# EAGLE design PrelimanaryV3 (EAGLE 9.5.2)
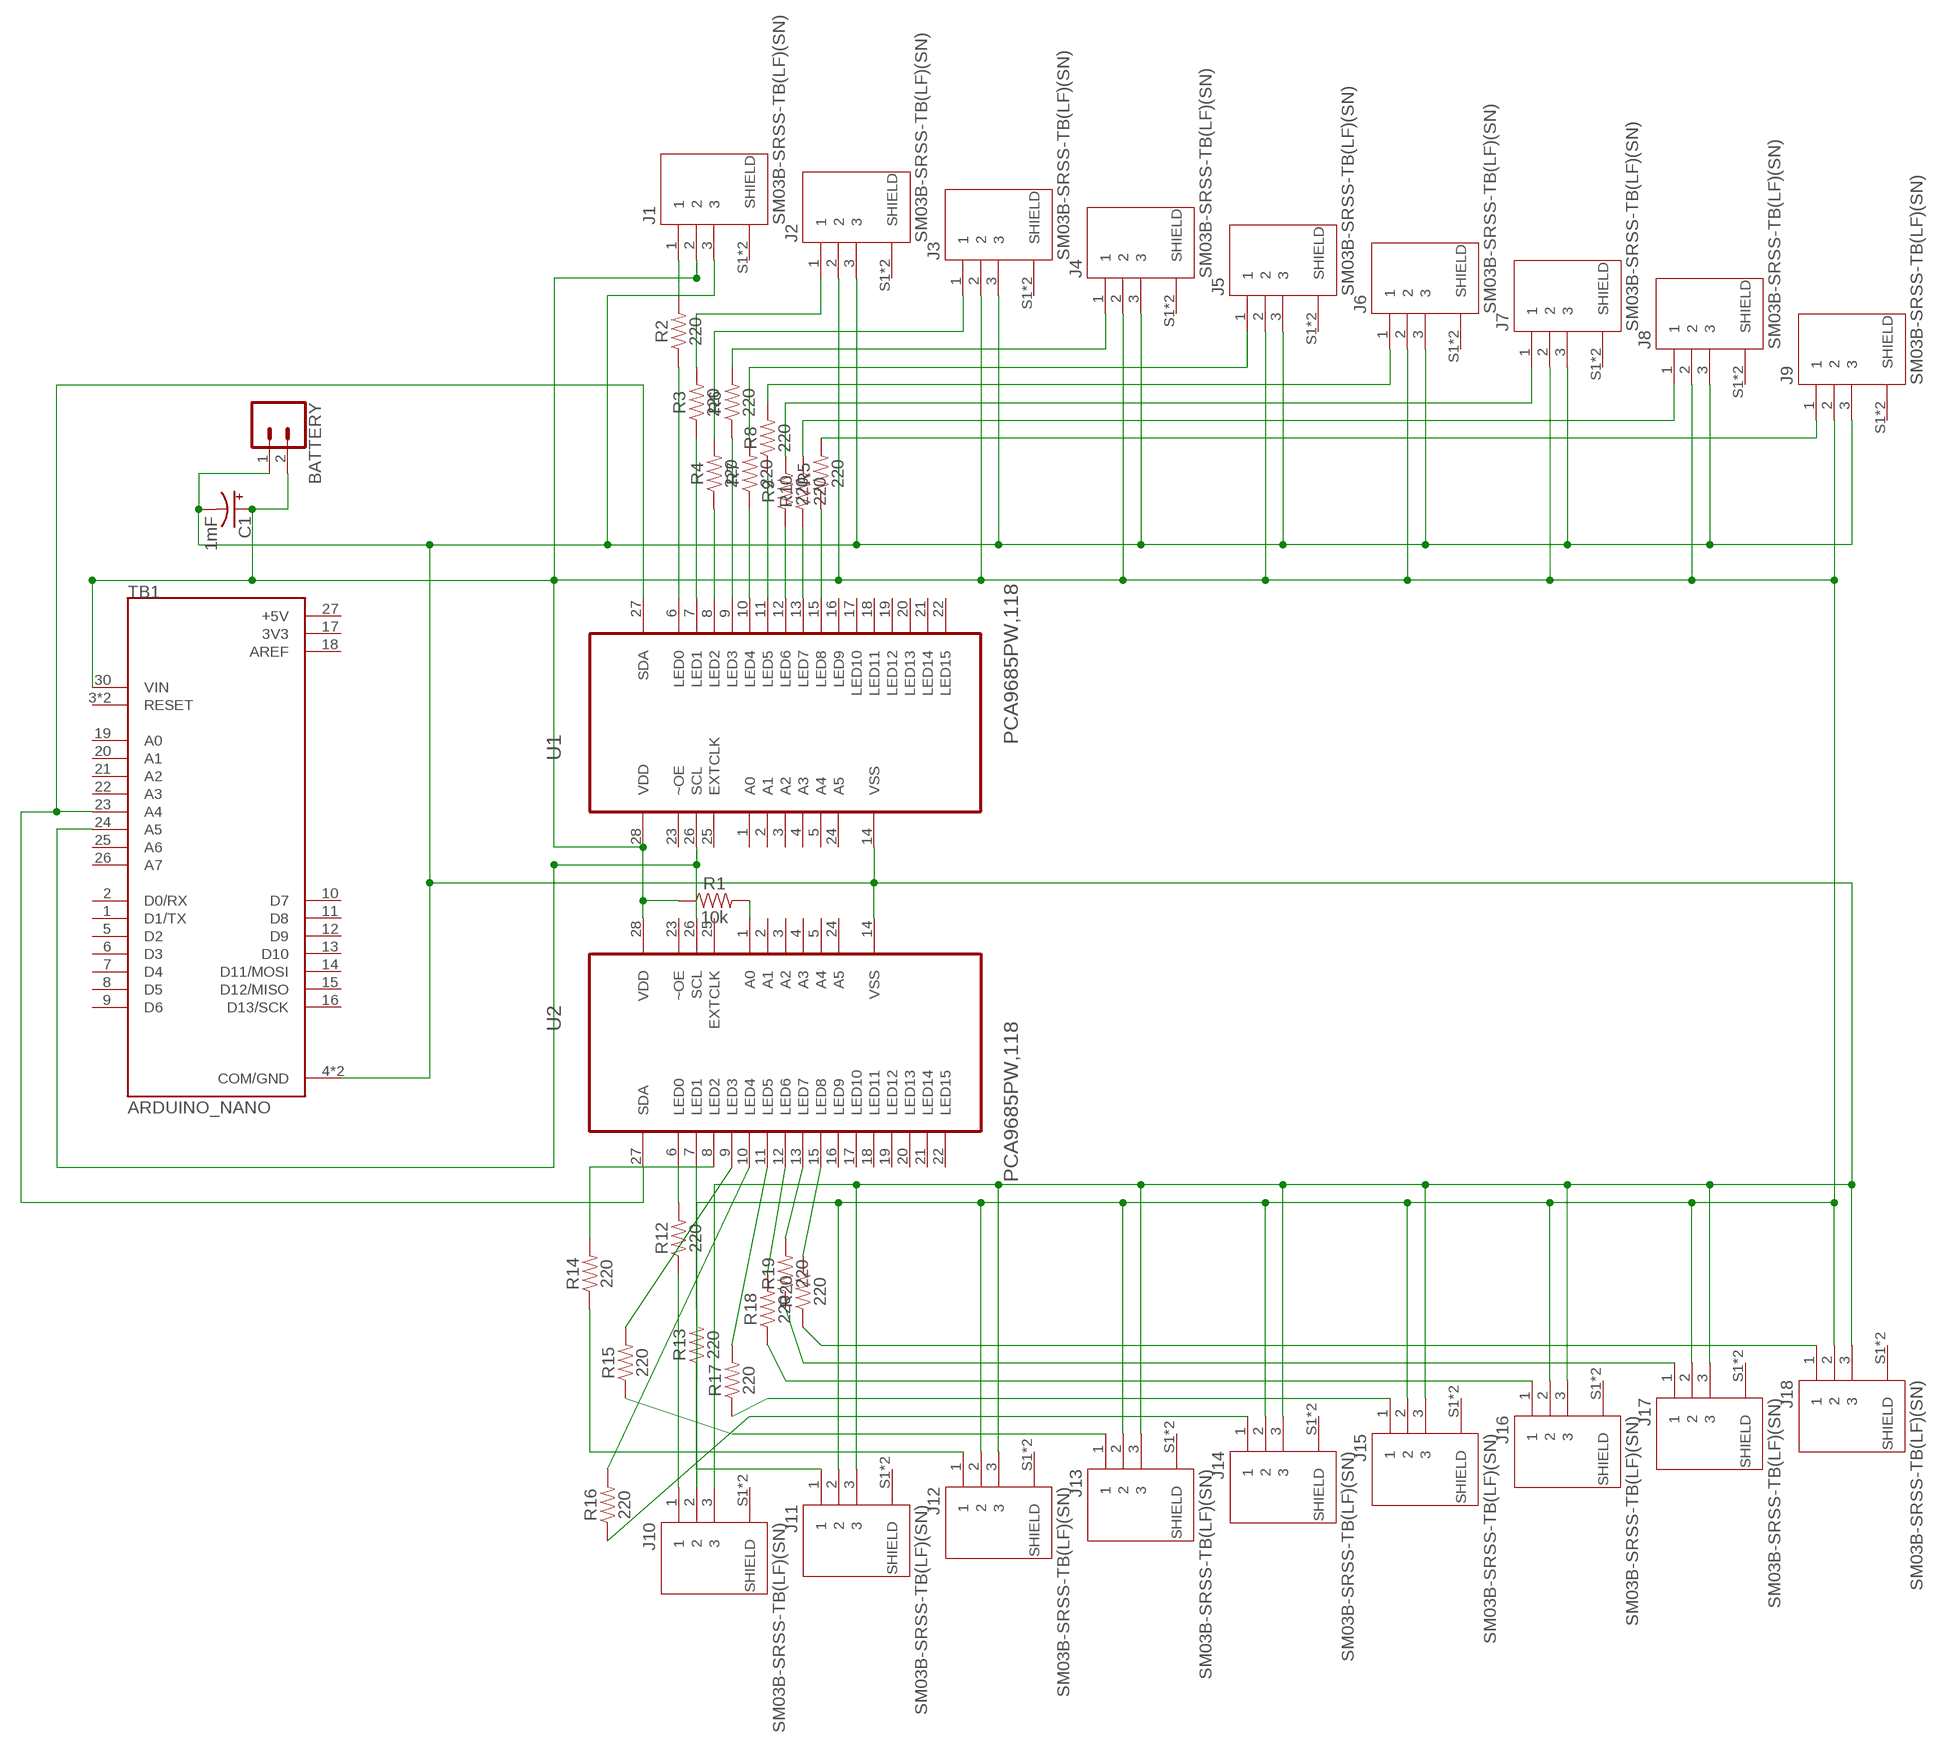
[diagram p0: schematic, sheet 1]

## Parts
BATTERY  CONN_021X02_NO_SILK  [1X02_NO_SILK]
C1  1mF  1000UF-RADIAL-5MM-25V-20%  [CPOL-RADIAL-5MM-10MM]
J1  SM03B-SRSS-TB(LF)(SN)  [JST_SM03B-SRSS-TB(LF)(SN)]
J2  SM03B-SRSS-TB(LF)(SN)  [JST_SM03B-SRSS-TB(LF)(SN)]
J3  SM03B-SRSS-TB(LF)(SN)  [JST_SM03B-SRSS-TB(LF)(SN)]
J4  SM03B-SRSS-TB(LF)(SN)  [JST_SM03B-SRSS-TB(LF)(SN)]
J5  SM03B-SRSS-TB(LF)(SN)  [JST_SM03B-SRSS-TB(LF)(SN)]
J6  SM03B-SRSS-TB(LF)(SN)  [JST_SM03B-SRSS-TB(LF)(SN)]
J7  SM03B-SRSS-TB(LF)(SN)  [JST_SM03B-SRSS-TB(LF)(SN)]
J8  SM03B-SRSS-TB(LF)(SN)  [JST_SM03B-SRSS-TB(LF)(SN)]
J9  SM03B-SRSS-TB(LF)(SN)  [JST_SM03B-SRSS-TB(LF)(SN)]
J10  SM03B-SRSS-TB(LF)(SN)  [JST_SM03B-SRSS-TB(LF)(SN)]
J11  SM03B-SRSS-TB(LF)(SN)  [JST_SM03B-SRSS-TB(LF)(SN)]
J12  SM03B-SRSS-TB(LF)(SN)  [JST_SM03B-SRSS-TB(LF)(SN)]
J13  SM03B-SRSS-TB(LF)(SN)  [JST_SM03B-SRSS-TB(LF)(SN)]
J14  SM03B-SRSS-TB(LF)(SN)  [JST_SM03B-SRSS-TB(LF)(SN)]
J15  SM03B-SRSS-TB(LF)(SN)  [JST_SM03B-SRSS-TB(LF)(SN)]
J16  SM03B-SRSS-TB(LF)(SN)  [JST_SM03B-SRSS-TB(LF)(SN)]
J17  SM03B-SRSS-TB(LF)(SN)  [JST_SM03B-SRSS-TB(LF)(SN)]
J18  SM03B-SRSS-TB(LF)(SN)  [JST_SM03B-SRSS-TB(LF)(SN)]
R1  10k  10KOHM-0402-1/16W-1%  [0402]
R2  220  220OHM-0603-1/10W-1%  [0603]
R3  220  220OHM-0603-1/10W-1%  [0603]
R4  220  220OHM-0603-1/10W-1%  [0603]
R5  220  220OHM-0603-1/10W-1%  [0603]
R6  220  220OHM-0603-1/10W-1%  [0603]
R7  220  220OHM-0603-1/10W-1%  [0603]
R8  220  220OHM-0603-1/10W-1%  [0603]
R9  220  220OHM-0603-1/10W-1%  [0603]
R10  220  220OHM-0603-1/10W-1%  [0603]
R12  220  220OHM-0603-1/10W-1%  [0603]
R13  220  220OHM-0603-1/10W-1%  [0603]
R14  220  220OHM-0603-1/10W-1%  [0603]
R15  220  220OHM-0603-1/10W-1%  [0603]
R16  220  220OHM-0603-1/10W-1%  [0603]
R17  220  220OHM-0603-1/10W-1%  [0603]
R18  220  220OHM-0603-1/10W-1%  [0603]
R19  220  220OHM-0603-1/10W-1%  [0603]
R20  220  220OHM-0603-1/10W-1%  [0603]
TB1  ARDUINO_NANO  [SHIELD_ARDUINO_NANO]
U1  PCA9685PW,118  [SOP65P640X110-28N]
U2  PCA9685PW,118  [SOP65P640X110-28N]

## Nets
N$1: R2.1 U1.6(LED0)
N$2: J2.1 R3.2
N$3: J3.1 R4.2
N$4: BATTERY.1 C1.- J1.3 J2.3 J3.3 J4.3 J5.3 J6.3 J7.3 J8.3 J9.3 J10.3 J11.3 J12.3 J13.3 J14.3 J15.3 J16.3 J17.3 J18.3 TB1.4(COM/GND) TB1.29(COM/GND) U1.14(VSS) U2.14(VSS)
N$5: TB1.23(A4) U1.27(SDA) U2.27(SDA)
N$6: TB1.24(A5) U1.26(SCL) U2.26(SCL)
N$7: J1.1 R2.2
N$8: J4.1 R6.2
N$9: J5.1 R7.2
N$10: J6.1 R8.2
N$11: J7.1 R9.2
N$12: J8.1 R10.2
N$13: J9.1 R5.2
N$14: J10.1 R12.1
N$15: J11.1 R13.1
N$16: J12.1 R14.1
N$17: J13.1 R15.1
N$18: J14.1 R16.1
N$19: J15.1 R17.1
N$20: J16.1 R18.1
N$21: J17.1 R19.1
N$22: J18.1 R20.1
N$23: BATTERY.2 C1.+ J1.2 J2.2 J3.2 J4.2 J5.2 J6.2 J7.2 J8.2 J9.2 J10.2 J11.2 J12.2 J13.2 J14.2 J15.2 J16.2 J17.2 J18.2 R1.1 TB1.30(VIN) U1.28(VDD) U2.28(VDD)
N$24: R3.1 U1.7(LED1)
N$25: R4.1 U1.8(LED2)
N$26: R6.1 U1.9(LED3)
N$27: R7.1 U1.10(LED4)
N$28: R8.1 U1.11(LED5)
N$29: R9.1 U1.12(LED6)
N$30: R10.1 U1.13(LED7)
N$31: R12.2 U2.6(LED0)
N$32: R13.2 U2.7(LED1)
N$33: R15.2 U2.9(LED3)
N$34: R16.2 U2.10(LED4)
N$35: R17.2 U2.11(LED5)
N$36: R18.2 U2.12(LED6)
N$37: R19.2 U2.13(LED7)
N$38: R20.2 U2.15(LED8)
N$39: R14.2 U2.8(LED2)
N$41: R5.1 U1.15(LED8)
N$42: R1.2 U2.1(A0)
Unconnected: J1.S1(SHIELD) J1.S2(SHIELD) J2.S1(SHIELD) J2.S2(SHIELD) J3.S1(SHIELD) J3.S2(SHIELD) J4.S1(SHIELD) J4.S2(SHIELD) J5.S1(SHIELD) J5.S2(SHIELD) J6.S1(SHIELD) J6.S2(SHIELD) J7.S1(SHIELD) J7.S2(SHIELD) J8.S1(SHIELD) J8.S2(SHIELD) J9.S1(SHIELD) J9.S2(SHIELD) J10.S1(SHIELD) J10.S2(SHIELD) J11.S1(SHIELD) J11.S2(SHIELD) J12.S1(SHIELD) J12.S2(SHIELD) J13.S1(SHIELD) J13.S2(SHIELD) J14.S1(SHIELD) J14.S2(SHIELD) J15.S1(SHIELD) J15.S2(SHIELD) J16.S1(SHIELD) J16.S2(SHIELD) J17.S1(SHIELD) J17.S2(SHIELD) J18.S1(SHIELD) J18.S2(SHIELD) TB1.1(D1/TX) TB1.2(D0/RX) TB1.3(RESET) TB1.5(D2) TB1.6(D3) TB1.7(D4) TB1.8(D5) TB1.9(D6) TB1.10(D7) TB1.11(D8) TB1.12(D9) TB1.13(D10) TB1.14(D11/MOSI) TB1.15(D12/MISO) TB1.16(D13/SCK) TB1.19(A0) TB1.20(A1) TB1.21(A2) TB1.22(A3) TB1.25(A6) TB1.26(A7) TB1.28(RESET) U1.1(A0) U1.2(A1) U1.3(A2) U1.4(A3) U1.5(A4) U1.16(LED9) U1.17(LED10) U1.18(LED11) U1.19(LED12) U1.20(LED13) U1.21(LED14) U1.22(LED15) U1.23(~OE) U1.24(A5) U1.25(EXTCLK) U2.2(A1) U2.3(A2) U2.4(A3) U2.5(A4) U2.16(LED9) U2.17(LED10) U2.18(LED11) U2.19(LED12) U2.20(LED13) U2.21(LED14) U2.22(LED15) U2.23(~OE) U2.24(A5) U2.25(EXTCLK)

## Power pins joined to a net without a drawn wire
3V3: TB1.17(3V3)
+5V: TB1.27(+5V)
AREF: TB1.18(AREF)

## Library data of the parts
BATTERY = SparkFun-Connectors:CONN_02: Multi connection point. Often used as Generic Header-pin footprint for 0.1 inch spaced/style header connections On any of the 0.1 inch spaced packages, you can populate with these: Break Away Headers - Straight <https://www.sparkfun.com/products/116> (PRT-00116) Break Away Male Headers - Right Angle <https://www.sparkfun.com/products/553> (PRT-00553) Female Headers <https://www.sparkfun.com/products/115> (PRT-00115) Break Away Headers - Machine Pin <https://www.sparkfun.com/products/117> (PRT-00117) Break Away Female Headers - Swiss Machine Pin <https://www.sparkfun.com/products/743> (PRT-00743) For SCREWTERMINALS and SPRING TERMINALS visit here: Screw Terimnals on SparkFun.com <https://www.sparkfun.com/search/results?term=Screw+Terminals> (5mm/3.5mm/2.54mm spacing) This device is also useful as a general connection point to wire up your design to another part of your project. Our various solder wires solder well into these plated through hole pads. Hook-Up Wire - Assortment (Stranded, 22 AWG) <https://www.sparkfun.com/products/11375> (PRT-11375) Hook-Up Wire - Assortment (Solid Core, 22 AWG) <https://www.sparkfun.com/products/11367> (PRT-11367) View the entire wire category on our website here <https://www.sparkfun.com/categories/141> Special notes: Molex polarized connector foot print use with: PRT-08233 with associated crimp pins and housings. 2.54_SCREWTERM for use with PRT-10571. 3.5mm Screw Terminal footprints for PRT-08084 5mm Screw Terminal footprints for use with PRT-08432
C1 = SparkFun-Capacitors:1000UF: 1,000µF/1mF ceramic capacitors A capacitor is a passive two-terminal electrical component used to store electrical energy temporarily in an electric field. CAP-08070; PROD_ID: CAP-09538
J1-J18 = JST-SH:SM03B-SRSS-TB(LF)(SN): SH Series 3 Position 1 mm Pitch Surface Mount Side Entry Shrouded Header; AVAILABILITY: Unavailable; DESCRIPTION: CONN HEADER SMD R/A 3POS 1MM; MF: JST Sales; MP: SM03B-SRSS-TB_LF__SN_; PACKAGE: None; PRICE: None
R1 = SparkFun-Resistors:10KOHM: 10kΩ resistor A resistor is a passive two-terminal electrical component that implements electrical resistance as a circuit element. Resistors act to reduce current flow, and, at the same time, act to lower voltage levels within circuits. - Wikipedia; PROD_ID: RES-14241
R2-R10 R12-R20 = SparkFun-Resistors:220OHM: 220Ω resistor A resistor is a passive two-terminal electrical component that implements electrical resistance as a circuit element. Resistors act to reduce current flow, and, at the same time, act to lower voltage levels within circuits. - Wikipedia; PROD_ID: RES-07861
TB1 = ARDUINO_NANO:ARDUINO_NANO: Arduino Nano, Through Hole; AVAILABILITY: Unavailable; DESCRIPTION: Dev.kit: Arduino; UART; ICSP, USB B mini, pin strips; MF: Arduino; MP: ARDUINO NANO; PACKAGE: None; PRICE: None
U1 U2 = PCA9685PW_118:PCA9685PW,118: 16-channel, 12-bit PWM Fm+ I2C-bus LED controller; AVAILABILITY: Unavailable; DESCRIPTION: PCA9685 Series 5.5V 25 mA 1 MHz 12-bit PWM Fm+I2C-Bus LED Controller - TSSOP-28; MF: NXP USA; MP: PCA9685PW,118; PACKAGE: TSSOP-28 NXP Semiconductors; PRICE: None

## Board
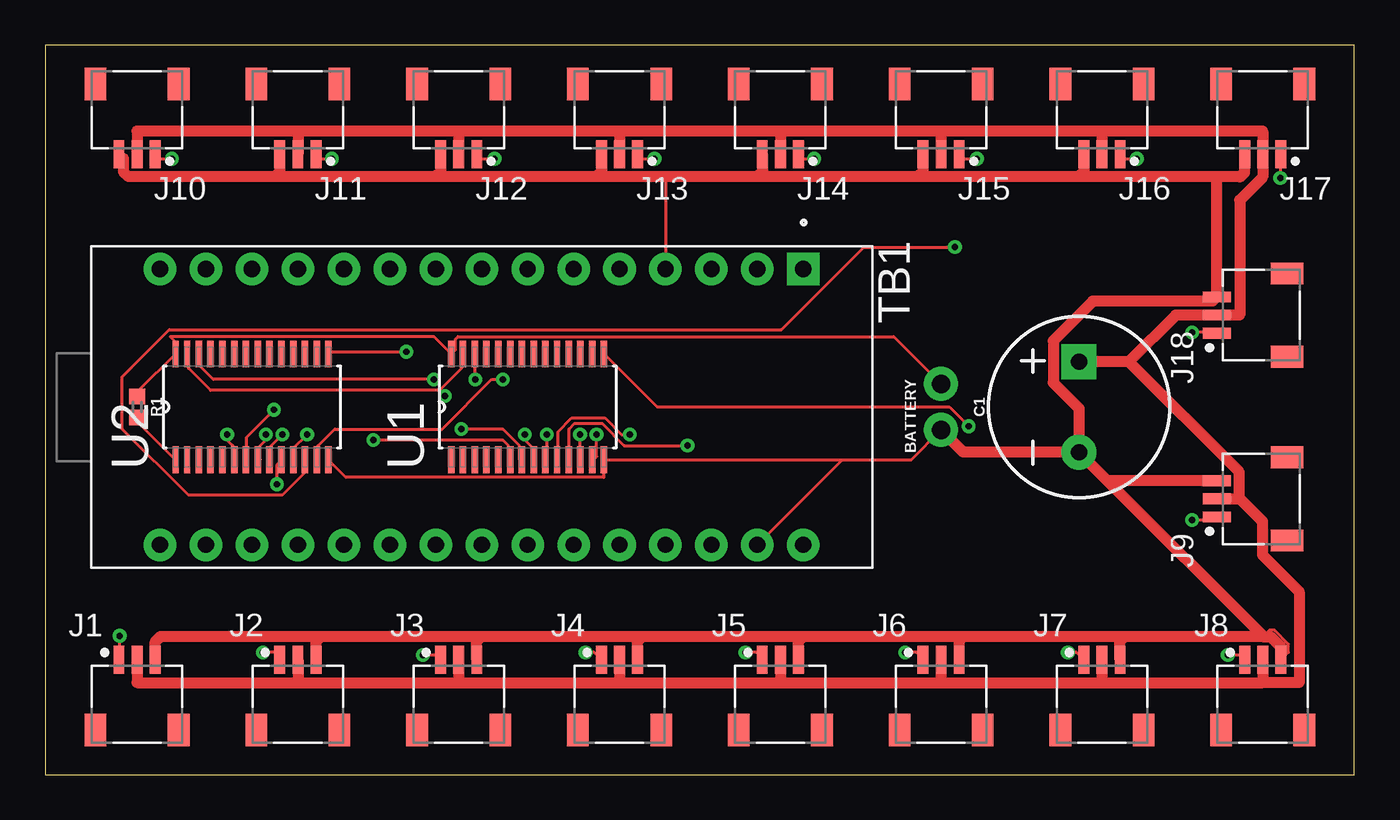
[diagram p1: board, top side]
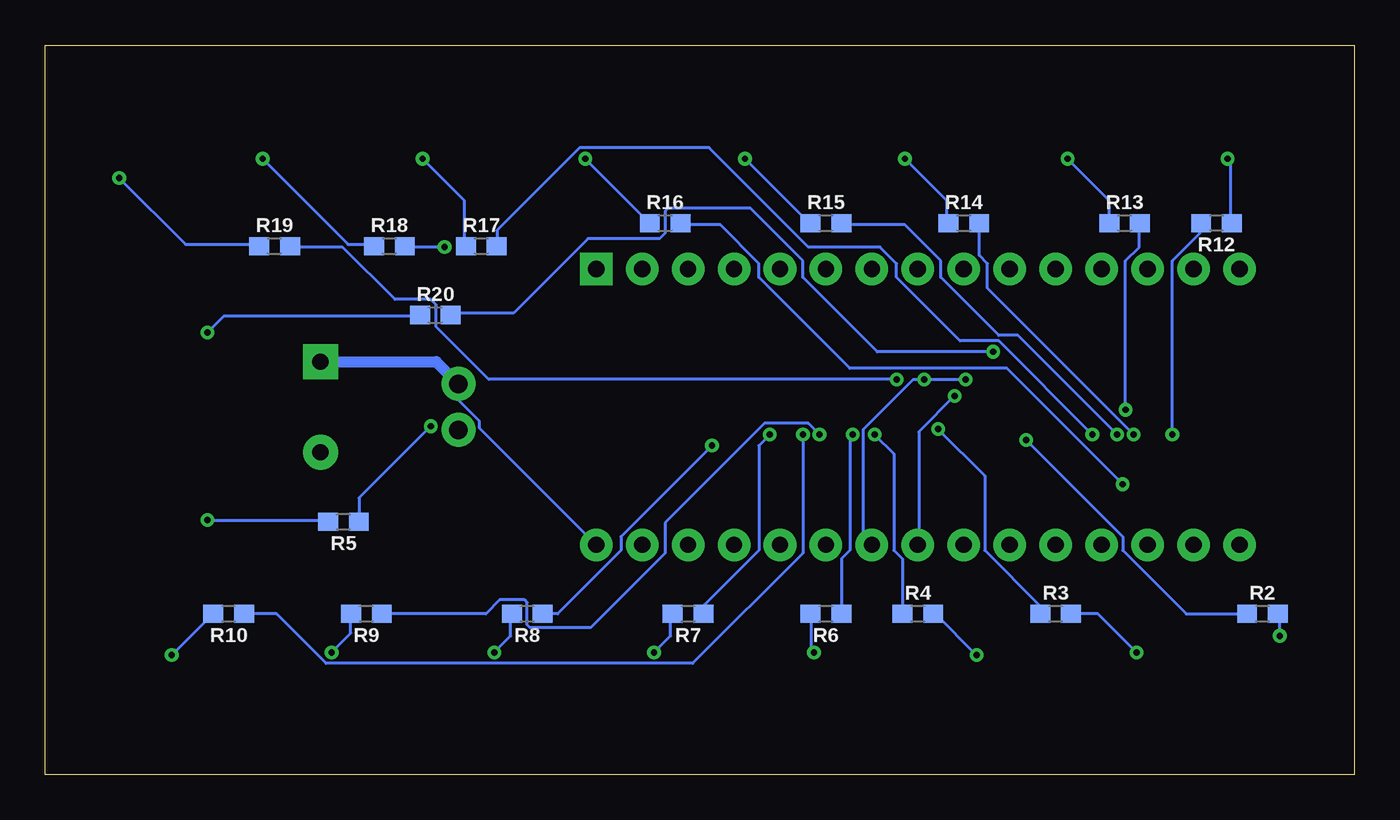
[diagram p2: board, bottom side, seen from below]

Size 72.37 x 40.31 mm. Coordinates in mm from the lower left corner, seen from the top.
Outline: 0,0 72.37,0 72.37,40.31 0,40.31 0,0
Copper layers (1*16): Top 0.035mm / dielectric 1.5mm / Bottom 0.035mm
Design rules "default": minimum track width 6mil, minimum drill 0.35mm, track to track 6mil, track to pad 6mil, pad to pad 6mil, via to via 6mil, smd to smd 6mil, copper to edge 40mil, drill to drill 6mil, minimum pad ring 10mil, minimum via ring 8mil, stop-mask expansion 4mil, vias tented up to drill 0mil, thermal gap 10mil

### Footprints (pad centres in the part's own frame; a part is rotated, then mirrored left to right if it is on the bottom)
1X02_NO_SILK = drill 1.016 pad 1.88: 1 0,0; 2 2.54,0
CPOL-RADIAL-5MM-10MM = drill 0.9 pad 1.93 square: + 2.5,0 | drill 0.9 pad 1.93: - -2.5,0
JST_SM03B-SRSS-TB(LF)(SN) = smd 0.6 x 1.55: 1 -1,0; 2 0,0; 3 1,0 | smd 1.2 x 1.8: S1 -2.3,-3.875; S2 2.3,-3.875
0402 = smd 0.85 x 0.9: 1 -0.58,0; 2 0.58,0
0603 = smd 1.1 x 1: 1 -0.85,0; 2 0.85,0
SHIELD_ARDUINO_NANO = drill 0.9 pad 1.8 square: 1 -7.62,17.78 | drill 0.9 pad 1.8: 2 -7.62,15.24; 3 -7.62,12.7; 4 -7.62,10.16; 5 -7.62,7.62; 6 -7.62,5.08; 7 -7.62,2.54; 8 -7.62,0; 9 -7.62,-2.54; 10 -7.62,-5.08; 11 -7.62,-7.62; 12 -7.62,-10.16; 13 -7.62,-12.7; 14 -7.62,-15.24; 15 -7.62,-17.78; 16 7.62,-17.78; 17 7.62,-15.24; 18 7.62,-12.7; 19 7.62,-10.16; 20 7.62,-7.62; 21 7.62,-5.08; 22 7.62,-2.54; 23 7.62,0; 24 7.62,2.54; 25 7.62,5.08; 26 7.62,7.62; 27 7.62,10.16; 28 7.62,12.7; 29 7.62,15.24; 30 7.62,17.78
SOP65P640X110-28N = smd 1.473 x 0.356: 1 -2.921,4.216; 2 -2.921,3.581; 3 -2.921,2.921; 4 -2.921,2.286; 5 -2.921,1.626; 6 -2.921,0.965; 7 -2.921,0.33; 8 -2.921,-0.33; 9 -2.921,-0.965; 10 -2.921,-1.626; 11 -2.921,-2.286; 12 -2.921,-2.921; 13 -2.921,-3.581; 14 -2.921,-4.216; 15 2.921,-4.216; 16 2.921,-3.581; 17 2.921,-2.921; 18 2.921,-2.286; 19 2.921,-1.626; 20 2.921,-0.965; 21 2.921,-0.33; 22 2.921,0.33; 23 2.921,0.965; 24 2.921,1.626; 25 2.921,2.286; 26 2.921,2.921; 27 2.921,3.581; 28 2.921,4.216

### Placement (x,y rotation side)
BATTERY  49.53,19.05 90 top
C1  57.15,20.32 90 top
J1  5.08,6.35 0 top
J2  13.97,6.35 0 top
J3  22.86,6.35 0 top
J4  31.75,6.35 0 top
J5  40.64,6.35 0 top
J6  49.53,6.35 0 top
J7  58.42,6.35 0 top
J8  67.31,6.35 0 top
J9  64.77,15.24 90 top
J10  5.08,34.29 180 top
J11  13.97,34.29 180 top
J12  22.86,34.29 180 top
J13  31.75,34.29 180 top
J14  40.64,34.29 180 top
J15  49.53,34.29 180 top
J16  58.42,34.29 180 top
J17  67.31,34.29 180 top
J18  64.77,25.4 90 top
R1  5.08,20.32 270 top
R2  5.08,8.89 0 bottom
R3  16.51,8.89 0 bottom
R4  24.13,8.89 0 bottom
R5  55.88,13.97 180 bottom
R6  29.21,8.89 180 bottom
R7  36.83,8.89 180 bottom
R8  45.72,8.89 180 bottom
R9  54.61,8.89 180 bottom
R10  62.23,8.89 180 bottom
R12  7.62,30.48 180 bottom
R13  12.7,30.48 0 bottom
R14  21.59,30.48 0 bottom
R15  29.21,30.48 0 bottom
R16  38.1,30.48 0 bottom
R17  48.26,29.21 0 bottom
R18  53.34,29.21 0 bottom
R19  59.69,29.21 0 bottom
R20  50.8,25.4 0 bottom
TB1  24.13,20.32 270 top
U1  26.67,20.32 90 top
U2  11.43,20.32 90 top

### Tracks (layer width: path | path; a pad name or v marks a point on that pad's centre or on a via)
N$1  (via drill 0.35)
  Top 0.152: v18.14,18.49 25.3,18.49 25.6,18.19 25.6,17.42 U1.6
  Bottom 0.152: R2.1 9.3,8.89 12.8,12.39 12.8,13.16 v18.14,18.49
N$2  (via drill 0.35)
  Top 0.152: v12.04,6.76 12.65,6.76 12.95,6.45 J2.1
  Bottom 0.152: R3.2 14.17,8.89 v12.04,6.76
N$3  (via drill 0.35)
  Top 0.152: v20.88,6.6 21.64,6.6 21.79,6.45 J3.1
  Bottom 0.152: v20.88,6.6 23.16,8.89 R4.2
N$4
  Top 0.152: U2.14 16.61,16.43 30.89,16.43 U1.14 44.07,17.4 | 44.07,17.4 47.88,17.4 BATTERY.1 | TB1.29 44.07,17.4 | J10.3 4.11,34.19 4.32,34.05 | 67.33,7.64 67.67,7.98 67.97,7.98 68.73,7.21 68.73,6.76 68.43,6.45 J8.3 | 34.29,33.06 TB1.4
  Top 0.61: 68.31,7.07 67.76,7.62 67.35,7.62 67.33,7.64 | 12.7,33.06 4.59,33.06 4.32,33.33 4.32,34.05 | 12.7,33.06 21.59,33.06 | 21.59,33.06 30.48,33.06 | 30.48,33.06 34.29,33.06 39.37,33.06 | 39.37,33.06 48.26,33.06 | 48.26,33.06 57.15,33.06 | 57.15,33.06 64.77,33.06 | 64.77,33.06 66,33.06 66.04,33.02 66.31,33.29 J17.3 | 64.77,33.06 J18.3 64.53,26.16 57.91,26.16 55.73,23.97 55.73,21.66 57.15,20.24 C1.- | J11.3 12.97,33.33 12.7,33.06 | J12.3 21.86,33.33 21.59,33.06 | J13.3 30.75,33.33 30.48,33.06 | J14.3 39.64,33.33 39.37,33.06 | J15.3 48.53,33.33 48.26,33.06 | J16.3 57.42,33.33 57.15,33.06 | C1.- 50.76,17.82 BATTERY.1 | C1.- 58.73,16.24 | 58.73,16.24 67.33,7.64 | J1.3 6.08,7.35 6.37,7.64 15.24,7.64 | 15.24,7.64 24.13,7.64 | 24.13,7.64 33.02,7.64 | 33.02,7.64 41.91,7.64 | 41.91,7.64 50.8,7.64 | 50.8,7.64 59.69,7.64 | 59.69,7.64 67.33,7.64 | J2.3 14.97,7.37 15.24,7.64 | J3.3 23.86,7.37 24.13,7.64 | J4.3 32.75,7.37 33.02,7.64 | J5.3 41.64,7.37 41.91,7.64 | J6.3 50.53,7.37 50.8,7.64 | J7.3 59.42,7.37 59.69,7.64 | J9.3 58.73,16.24
N$5  (via drill 0.35)
  Top 0.152: 21.79,21.23 9.14,21.23 7.92,22.45 7.92,23.22 U2.27 | 21.79,21.23 23.01,22.45 23.01,23.22 U1.27 | 21.79,21.23 v22.1,20.93
  Bottom 0.152: v22.1,20.93 24.08,18.95 24.08,12.7 TB1.23
N$6  (via drill 0.35)
  Top 0.152: v21.49,21.84 9.3,21.84 8.53,22.61 8.53,23.22 U2.26 | v23.77,21.84 23.77,23.22 U1.26
  Bottom 0.152: v21.49,21.84 v23.77,21.84 24.38,21.84 27.13,19.1 27.13,13.16 TB1.24
N$7  (via drill 0.35)
  Top 0.152: v4.11,7.67 4.11,6.45 J1.1
  Bottom 0.152: v4.11,7.67 4.11,8.89 R2.2
N$8  (via drill 0.35)
  Top 0.152: v29.87,6.76 30.33,6.76 30.63,6.45 J4.1
  Bottom 0.152: v29.87,6.76 30.02,6.91 30.02,8.89 R6.2
N$9  (via drill 0.35)
  Top 0.152: v38.71,6.76 39.32,6.76 39.62,6.45 J5.1
  Bottom 0.152: v38.71,6.76 37.8,7.67 37.8,8.89 R7.2
N$10  (via drill 0.35)
  Top 0.152: v47.55,6.76 48.16,6.76 48.46,6.45 J6.1
  Bottom 0.152: v47.55,6.76 46.63,7.67 46.63,8.89 R8.2
N$11  (via drill 0.35)
  Top 0.152: v56.54,6.76 57,6.76 57.3,6.45 J7.1
  Bottom 0.152: v56.54,6.76 55.47,7.82 55.47,8.89 R9.2
N$12  (via drill 0.35)
  Top 0.152: v65.38,6.6 66.14,6.6 66.29,6.45 J8.1
  Bottom 0.152: v65.38,6.6 63.09,8.89 R10.2
N$13  (via drill 0.35)
  Top 0.152: v63.4,14.07 64.62,14.07 64.77,14.22 J9.1
  Bottom 0.152: v63.4,14.07 56.85,14.07 R5.2
N$14  (via drill 0.35)
  Top 0.152: v7.01,34.04 6.25,34.04 6.1,34.19 J10.1
  Bottom 0.152: v7.01,34.04 6.86,33.88 6.86,30.53 R12.1
N$15  (via drill 0.35)
  Top 0.152: v15.85,34.04 15.24,34.04 15.09,34.19 J11.1
  Bottom 0.152: v15.85,34.04 13.56,31.75 13.56,30.53 R13.1
N$16  (via drill 0.35)
  Top 0.152: v24.84,34.04 24.08,34.04 23.93,34.19 J12.1
  Bottom 0.152: v24.84,34.04 22.55,31.75 22.55,30.53 R14.1
N$17  (via drill 0.35)
  Top 0.152: v33.68,34.04 32.92,34.04 32.77,34.19 J13.1
  Bottom 0.152: v33.68,34.04 30.18,30.53 R15.1
N$18  (via drill 0.35)
  Top 0.152: v42.52,34.04 41.91,34.04 41.76,34.19 J14.1
  Bottom 0.152: v42.52,34.04 39.01,30.53 R16.1
N$19  (via drill 0.35)
  Top 0.152: v51.51,34.04 50.75,34.04 50.6,34.19 J15.1
  Bottom 0.152: v51.51,34.04 49.23,31.75 49.23,29.31 R17.1
N$20  (via drill 0.35)
  Top 0.152: v60.35,34.04 59.59,34.04 59.44,34.19 J16.1
  Bottom 0.152: v60.35,34.04 55.63,29.31 54.25,29.31 R18.1
N$21  (via drill 0.35)
  Top 0.152: v68.27,32.97 68.27,34.19 J17.1
  Bottom 0.152: v68.27,32.97 64.62,29.31 60.66,29.31 R19.1
N$22  (via drill 0.35)
  Top 0.152: v63.4,24.43 64.77,24.43 J18.1
  Bottom 0.152: v63.4,24.43 62.48,25.35 51.66,25.35 R20.1
N$23
  Top 0.152: BATTERY.2 46.91,24.21 22.82,24.21 22.68,24.07 22.68,23.47 U1.28 21.49,24.21 6.91,24.21 7.21,23.9 U2.28 7.16,23.22 5.18,21.23 5.18,20.93 R1.1
  Top 0.61: J8.2 67.31,5.08 | J1.2 5.08,5.08 13.97,5.08 | 13.97,5.08 22.86,5.08 | 22.86,5.08 31.75,5.08 | 31.75,5.08 40.64,5.08 | 40.64,5.08 49.53,5.08 | 49.53,5.08 58.42,5.08 | J2.2 13.97,5.08 | J3.2 22.86,5.08 | J4.2 31.75,5.08 | J5.2 40.64,5.08 | J6.2 49.53,5.08 | J7.2 58.42,5.08 | J10.2 5.08,35.56 13.97,35.56 | 58.42,35.56 67.31,35.56 J17.2 67.31,33.02 66.04,31.75 66.04,25.4 J18.2 62.49,25.4 59.91,22.82 | 58.42,35.56 49.53,35.56 | 49.53,35.56 40.64,35.56 | 40.64,35.56 31.75,35.56 | 31.75,35.56 22.86,35.56 | 22.86,35.56 13.97,35.56 | 13.97,35.56 J11.2 | 22.86,35.56 J12.2 | 31.75,35.56 J13.2 | 40.64,35.56 J14.2 | 49.53,35.56 J15.2 | 58.42,35.56 J16.2 | 58.42,5.08 67.31,5.08 | 67.31,5.08 69.33,5.08 69.33,10.11 67.29,12.15 67.29,13.99 66.04,15.24 | J9.2 66.04,15.24 | 66.04,15.24 66,15.28 66,16.73 59.91,22.82 | 59.91,22.82 C1.+
  Bottom 0.152: TB1.30 48.36,19.15 48.36,19.53 49.53,20.7 BATTERY.2
  Bottom 0.61: C1.+ 50.76,22.82 BATTERY.2
N$24  (via drill 0.35)
  Top 0.152: v23.01,19.1 25.3,19.1 26.21,18.19 26.21,17.42 U1.7
  Bottom 0.152: v23.01,19.1 20.42,16.51 20.42,12.39 17.37,9.35 17.37,8.89 R3.1
N$25  (via drill 0.35)
  Top 0.152: v26.52,18.8 26.52,18.49 26.97,18.03 26.97,17.42 U1.8
  Bottom 0.152: v26.52,18.8 25.45,17.73 25.45,12.39 24.99,11.94 24.99,8.89 R4.1
N$26  (via drill 0.35)
  Top 0.152: v27.74,18.8 27.74,17.42 U1.9
  Bottom 0.152: v27.74,18.8 27.89,18.64 27.89,12.39 28.35,11.94 28.35,8.89 R6.1
N$27  (via drill 0.35)
  Top 0.152: v32.31,18.8 31.85,18.8 30.94,19.71 29.11,19.71 28.35,18.95 28.35,17.42 U1.10
  Bottom 0.152: v32.31,18.8 32.92,18.19 32.92,12.39 35.97,9.35 35.97,8.89 R7.1
N$28  (via drill 0.35)
  Top 0.152: v35.51,18.19 32,18.19 30.79,19.41 29.26,19.41 28.96,19.1 U1.11
  Bottom 0.152: R8.1 44.04,8.89 40.54,12.39 40.54,13.16 v35.51,18.19
N$29  (via drill 0.35)
  Top 0.152: v29.57,18.8 29.57,17.42 U1.12
  Bottom 0.152: R9.1 48.01,8.89 47.24,9.65 45.87,9.65 45.72,9.5 45.72,8.28 45.57,8.13 42.22,8.13 38.1,12.24 38.1,13.92 32.61,19.41 30.18,19.41 v29.57,18.8
N$30  (via drill 0.35)
  Top 0.152: v30.48,18.8 30.48,17.58 30.33,17.42 U1.13
  Bottom 0.152: R10.1 59.59,8.89 56.85,6.15 36.58,6.15 30.48,12.24 v30.48,18.8
N$31  (via drill 0.35)
  Top 0.152: v10.06,18.8 10.06,18.49 10.36,18.19 10.36,17.42 U2.6
  Bottom 0.152: v10.06,18.8 10.06,28.4 8.53,29.92 8.53,30.38 R12.2
N$32  (via drill 0.35)
  Top 0.152: v12.65,20.17 11.12,18.64 11.12,17.42 U2.7
  Bottom 0.152: v12.65,20.17 12.65,28.4 11.89,29.16 11.89,30.38 R13.2
N$33  (via drill 0.35)
  Top 0.152: v13.11,18.8 12.5,18.19 12.5,17.42 U2.9
  Bottom 0.152: v13.11,18.8 18.59,24.28 19.66,24.28 22.86,27.48 22.86,28.4 24.84,30.38 28.35,30.38 R15.2
N$34  (via drill 0.35)
  Top 0.152: v12.8,16.05 12.8,17.12 12.95,17.27 U2.10
  Bottom 0.152: v12.8,16.05 19.2,22.45 27.89,22.45 32.92,27.48 32.92,28.24 35.05,30.38 37.19,30.38 R16.2
N$35  (via drill 0.35)
  Top 0.152: v14.48,18.8 13.72,18.03 U2.11
  Bottom 0.152: v14.48,18.8 19.66,23.98 21.79,23.98 25.3,27.48 25.3,28.24 26.21,29.16 30.18,29.16 35.66,34.65 42.82,34.65 47.4,30.07 47.4,29.31 R17.2
N$36  (via drill 0.35)
  Top 0.152: v50.29,29.16 45.26,29.16 40.69,24.59 6.86,24.59 4.27,22 4.27,19.1 7.92,15.44 13.11,15.44 14.33,16.66 14.33,17.27 U2.12
  Bottom 0.152: v50.29,29.16 52.43,29.16 R18.2
N$37  (via drill 0.35)
  Top 0.152: v25.3,21.84 24.69,21.84 21.95,19.1 16,19.1 15.09,18.19 15.09,17.42 U2.13
  Bottom 0.152: v25.3,21.84 47.85,21.84 50.75,24.74 50.75,25.96 51.05,26.26 53.04,26.26 55.93,29.16 58.83,29.16 R19.2
N$38  (via drill 0.35)
  Top 0.152: v19.96,23.37 15.7,23.37 U2.15
  Bottom 0.152: v19.96,23.37 26.36,23.37 30.48,27.48 30.48,28.4 33.38,31.29 37.95,31.29 38.1,31.14 38.1,29.92 38.41,29.62 42.37,29.62 46.48,25.5 49.84,25.5 R20.2
N$39  (via drill 0.35)
  Top 0.152: v12.19,18.8 12.19,18.49 11.89,18.19 11.89,17.42 U2.8
  Bottom 0.152: v12.19,18.8 20.27,26.87 20.27,28.24 20.73,28.7 20.73,30.38 R14.2
N$41  (via drill 0.35)
  Top 0.152: v51.05,19.25 49.99,20.32 33.83,20.32 30.94,23.22 U1.15
  Bottom 0.152: v51.05,19.25 55.02,15.29 55.02,14.07 R5.1
N$42
  Top 0.152: R1.2 5.18,19.71 5.18,19.41 7.16,17.42 U2.1